# EAGLE design ledd1 (EAGLE 7.1.0)
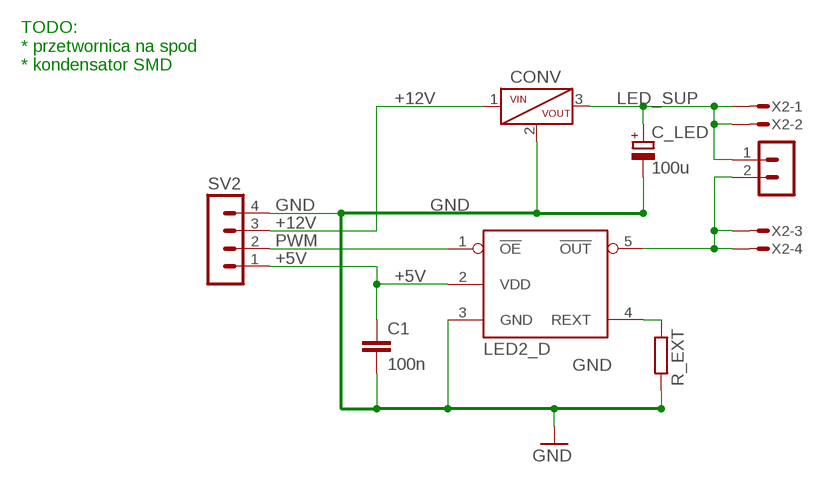
[diagram p0: schematic, sheet 1]

## Parts
C1  100n  C-EUC0603  [C0603]
C_LED  100u  CPOL-EUE2-4  [E2-4]
CONV  POLOLU-799  [POLOLU-799]
LED2_D  LED1_drv  MBI1801  [TO-265]
R_EXT  R-EU_R0603  [R0603]
SV2  MA04-1  [MA04-1]
SV3  MA02-1  [MA03-1]
X2  LEDOUT  MICROMATCH-4  [MICROMATCH-4]

## Nets
+5V: C1.1 LED2_D.2(VDD) SV2.1
+12V: CONV.1(VIN) SV2.3
GND: C1.2 C_LED.- CONV.2(GND) LED2_D.3(GND) R_EXT.2 SV2.4
LED_SUP: C_LED.+ CONV.3(VOUT) SV3.1 X2.1 X2.2
N$1: LED2_D.4(REXT) R_EXT.1
N$7: LED2_D.5(!OUT) SV3.2 X2.3 X2.4
PWM: LED2_D.1(!OE) SV2.2

## Notes on the sheet
- TODO:
  * przetwornica na spod
  * kondensator SMD

## Power pins joined to a net without a drawn wire
GND: LED2_D.6(GND)

## Library data of the parts
C1 = rcl:C-EU: CAPACITOR, European symbol
C_LED = rcl:CPOL-EU: POLARIZED CAPACITOR, European symbol
CONV = pololu:POLOLU-799: Pololu Adjustable Boost Regulator 4-25V; OC_FARNELL: unknown; OC_NEWARK: unknown
LED2_D = moja:MBI1801
R_EXT = rcl:R-EU_: RESISTOR, European symbol
SV2 = con-lstb:MA04-1: PIN HEADER; OC_FARNELL: unknown; OC_NEWARK: unknown
SV3 = wb:MA02-1: PIN HEADER; OC_FARNELL: unknown; OC_NEWARK: unknown
X2 = con-maritex:MICROMATCH-4: MicroMaTch 4 7-215464-4 / 0-215464-4 Drawing Number C-215464 DDEController.pdf

## Board
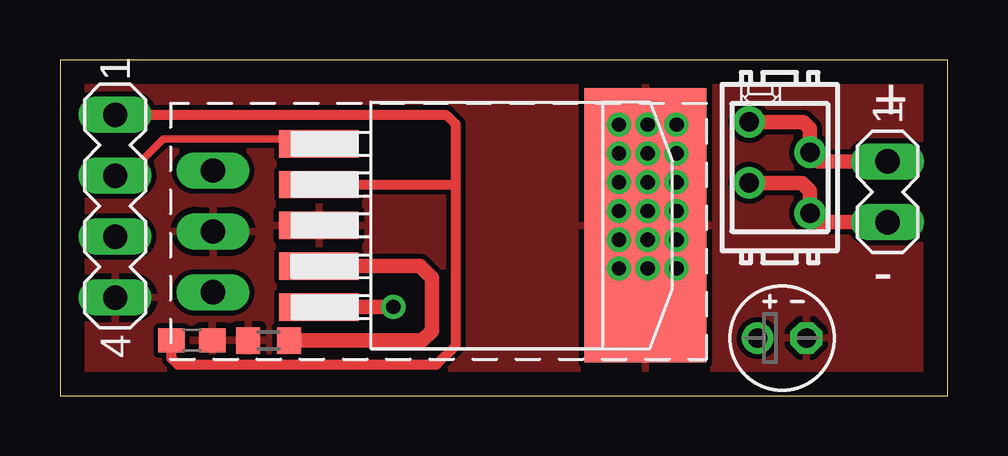
[diagram p1: board, top side]
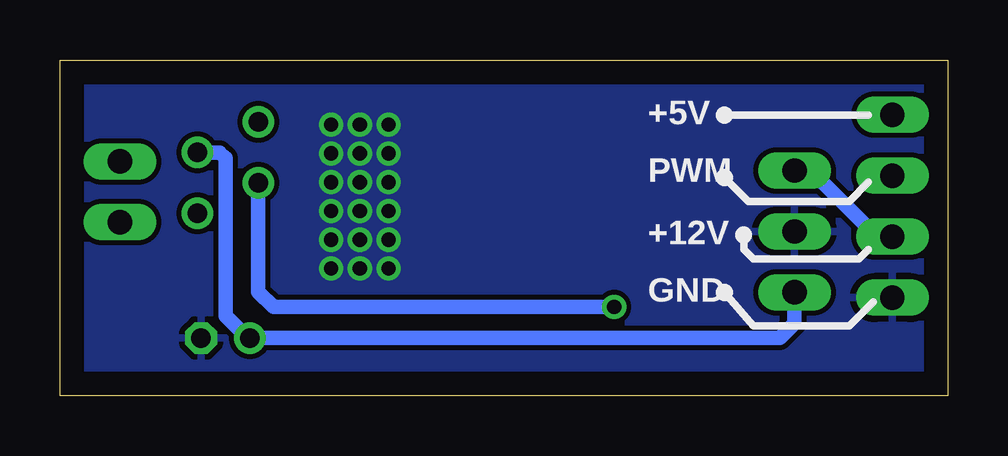
[diagram p2: board, bottom side, seen from below]

Size 37 x 14 mm. Coordinates in mm from the lower left corner, seen from the top.
Outline: 0,0 37,0 37,14 0,14 0,0
Copper layers (1*16): Top 0.035mm / dielectric 1.5mm / Bottom 0.035mm
Design rules "default": minimum track width 10mil, minimum drill 0.6mm, track to track 8mil, track to pad 8mil, pad to pad 8mil, via to via 8mil, smd to smd 8mil, copper to edge 1mm, drill to drill 8mil, minimum pad ring 10mil, minimum via ring 8mil, stop-mask expansion 4mil, vias tented up to drill 0mil, thermal gap 10mil

### Footprints (pad centres in the part's own frame; a part is rotated, then mirrored left to right if it is on the bottom)
C0603 = smd 1.1 x 1: 1 -0.85,0; 2 0.85,0
E2-4 = drill 0.813 pad 1.27: + -1.016,0 | drill 0.813 pad 1.27 octagon: - 1.016,0
POLOLU-799 = drill 1.016 long: 1 -2.286,-7.12; 2 0.254,-7.12; 3 2.794,-7.12
TO-265 = smd 1.143 x 3.302: 1 -3.404,-6.807; 2 -1.702,-6.807; 3 0,-6.807; 4 1.702,-6.807; 5 3.404,-6.807 | smd 11.43 x 5.08: 6 0,6.807
R0603 = smd 1 x 1.1: 1 -0.85,0; 2 0.85,0
MA04-1 = drill 1.016 long: 1 -3.81,0; 2 -1.27,0; 3 1.27,0; 4 3.81,0
MA03-1 = drill 1.016 long: 1 -1.27,0; 2 1.27,0
MICROMATCH-4 = drill 0.813: 1 1.905,1.27; 2 0.635,-1.27; 3 -0.635,1.27; 4 -1.905,-1.27

### Placement (x,y rotation side)
C1  5.5,2.3 0 top
C_LED  30.1,2.4 0 top
CONV  13.5,7.1 270 top
LED2_D  17.6,7.1 270 top
R_EXT  8.7,2.3 180 top
SV2  2.3,7.9 270 top
SV3  34.5,8.5 270 top
X2  30,9.51 90 top

### Tracks (layer width: path | path; a pad name or v marks a point on that pad's centre or on a via)
+5V
  Top 0.406: 16.5,8.7 16.5,2.1 15.7,1.3 4.9,1.3 4.65,1.55 4.65,2.25 4.7,2.3 C1.1 | 16.5,8.7 16.5,11.3 16.09,11.71 SV2.1 | LED2_D.2 16.4,8.8 16.5,8.7
+12V
  Bottom 0.61: SV2.3 2.94,6.63 5.7,9.39 CONV.1
GND  (via drill 0.6)
  other vias: 23.3,11.3 23.3,10.1 23.3,8.9 23.3,7.7 23.3,6.5 23.3,5.3 24.5,5.3 24.5,6.5 24.5,7.7 24.5,8.9 24.5,10.1 24.5,11.3 25.7,11.3 25.7,10.1 25.7,8.9 25.7,7.7 25.7,6.5 25.7,5.3
  pour Top: -0.1,13.9 37.3,13.9 37.3,-0.1 -0.1,-0.1
  pour Bottom: -0.1,13.9 37.3,13.9 37.3,-0.1 -0.1,-0.1
LED_SUP
  Top 0.61: X2.1 30.98,11.41 31.27,11.13 X2.2 31.64,9.77 SV3.1
  Bottom 0.406: 29.17,2.4 C_LED.+
  Bottom 0.61: X2.2 30.34,10.14 30.1,9.9 30.1,3.33 29.17,2.4 | C_LED.+ 7,2.4 6.38,3.02 CONV.3
N$1
  Top 0.61: R_EXT.1 15.1,2.3 15.5,2.7 15.5,4.9 15,5.4 LED2_D.4
N$7  (via drill 0.6)
  Top 0.61: X2.3 30.93,8.88 31.27,8.53 X2.4 31.27,7.53 31.57,7.23 SV3.2 | v13.9,3.7 LED2_D.5
  Bottom 0.61: v13.9,3.7 28.1,3.7 28.73,4.33 X2.3
PWM
  Top 0.305: LED2_D.1 10.6,10.7 4.3,10.7 2.77,9.17 SV2.2

### Text on the board
tNames: + | -
bNames: +5V | PWM | +12V | GND